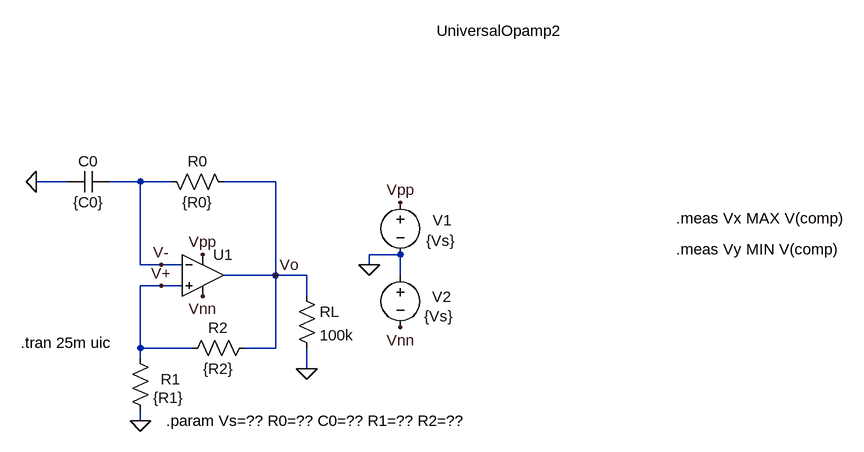
[diagram p0: schematic CompHistereseFig.asc]
CompHistereseFig.asc, the LTspice schematic file:
Version 4
SHEET 1 1160 680
WIRE -48 80 -96 80
WIRE 64 80 16 80
WIRE 112 80 64 80
WIRE 272 80 192 80
WIRE 464 192 416 192
WIRE 64 208 64 80
WIRE 96 208 64 208
WIRE 128 208 96 208
WIRE 416 208 416 192
WIRE 272 224 272 80
WIRE 272 224 192 224
WIRE 320 224 272 224
WIRE 464 224 464 192
WIRE 96 240 64 240
WIRE 128 240 96 240
WIRE 320 256 320 224
WIRE 64 336 64 240
WIRE 144 336 64 336
WIRE 272 336 272 224
WIRE 272 336 224 336
WIRE 64 352 64 336
WIRE 320 368 320 336
WIRE 64 448 64 432
FLAG 464 112 Vpp
FLAG 416 208 0
FLAG 464 304 Vnn
FLAG 320 368 0
FLAG 64 448 0
FLAG 272 224 Vo
FLAG 160 192 Vpp
FLAG 160 256 Vnn
FLAG 96 240 V+
FLAG 96 208 V-
FLAG -96 80 0
SYMBOL voltage 464 96 R0
WINDOW 123 0 0 Left 0
WINDOW 39 0 0 Left 0
WINDOW 0 50 43 Left 2
WINDOW 3 40 75 Left 2
SYMATTR InstName V1
SYMATTR Value {Vs}
SYMBOL voltage 464 208 R0
WINDOW 123 0 0 Left 0
WINDOW 39 0 0 Left 0
WINDOW 0 49 49 Left 2
WINDOW 3 37 79 Left 2
SYMATTR InstName V2
SYMATTR Value {Vs}
SYMBOL res 304 240 R0
SYMATTR InstName RL
SYMATTR Value 100k
SYMBOL res 240 320 R90
WINDOW 0 0 56 VBottom 2
WINDOW 3 32 56 VTop 2
SYMATTR InstName R2
SYMATTR Value {R2}
SYMBOL res 48 336 R0
WINDOW 0 47 48 Left 2
SYMATTR InstName R1
SYMATTR Value {R1}
SYMBOL Opamps\\UniversalOpamp2 160 224 R0
SYMATTR InstName U1
SYMBOL cap 16 64 R90
WINDOW 0 0 32 VBottom 2
WINDOW 3 32 32 VTop 2
SYMATTR InstName C0
SYMATTR Value {C0}
SYMBOL res 96 64 M90
WINDOW 0 0 56 VBottom 2
WINDOW 3 32 56 VTop 2
SYMATTR InstName R0
SYMATTR Value {R0}
TEXT 104 448 Left 2 !.param Vs=?? R0=?? C0=?? R1=?? R2=??
TEXT 888 136 Left 2 !.meas Vx MAX V(comp)
TEXT 888 184 Left 2 !.meas Vy MIN V(comp)
TEXT 520 -152 Left 2 !UniversalOpamp2
TEXT -120 328 Left 2 !.tran 25m uic

The netlist it stands for:
* CompHistereseFig.asc
V1 Vpp 0 {Vs}
V2 0 Vnn {Vs}
RL Vo 0 100k
R2 Vo V+ {R2}
R1 V+ 0 {R1}
XU1 V+ V- Vpp Vnn Vo level.2 Avol=1Meg GBW=10Meg Slew=10Meg ilimit=25m rail=0 Vos=0 phimargin=45 en=0 enk=0 in=0 ink=0 Rin=500Meg  ; pins IN+ IN- V+ V- OUT
C0 V- 0 {C0}
R0 V- Vo {R0}
.param Vs=?? R0=?? C0=?? R1=?? R2=??
.meas Vx MAX V(comp)
.meas Vy MIN V(comp)
UniversalOpamp2
.tran 25m uic
.lib UniversalOpamps2.sub
.backanno
.end